# EAGLE design CAN-MPU (EAGLE 9.1.1)
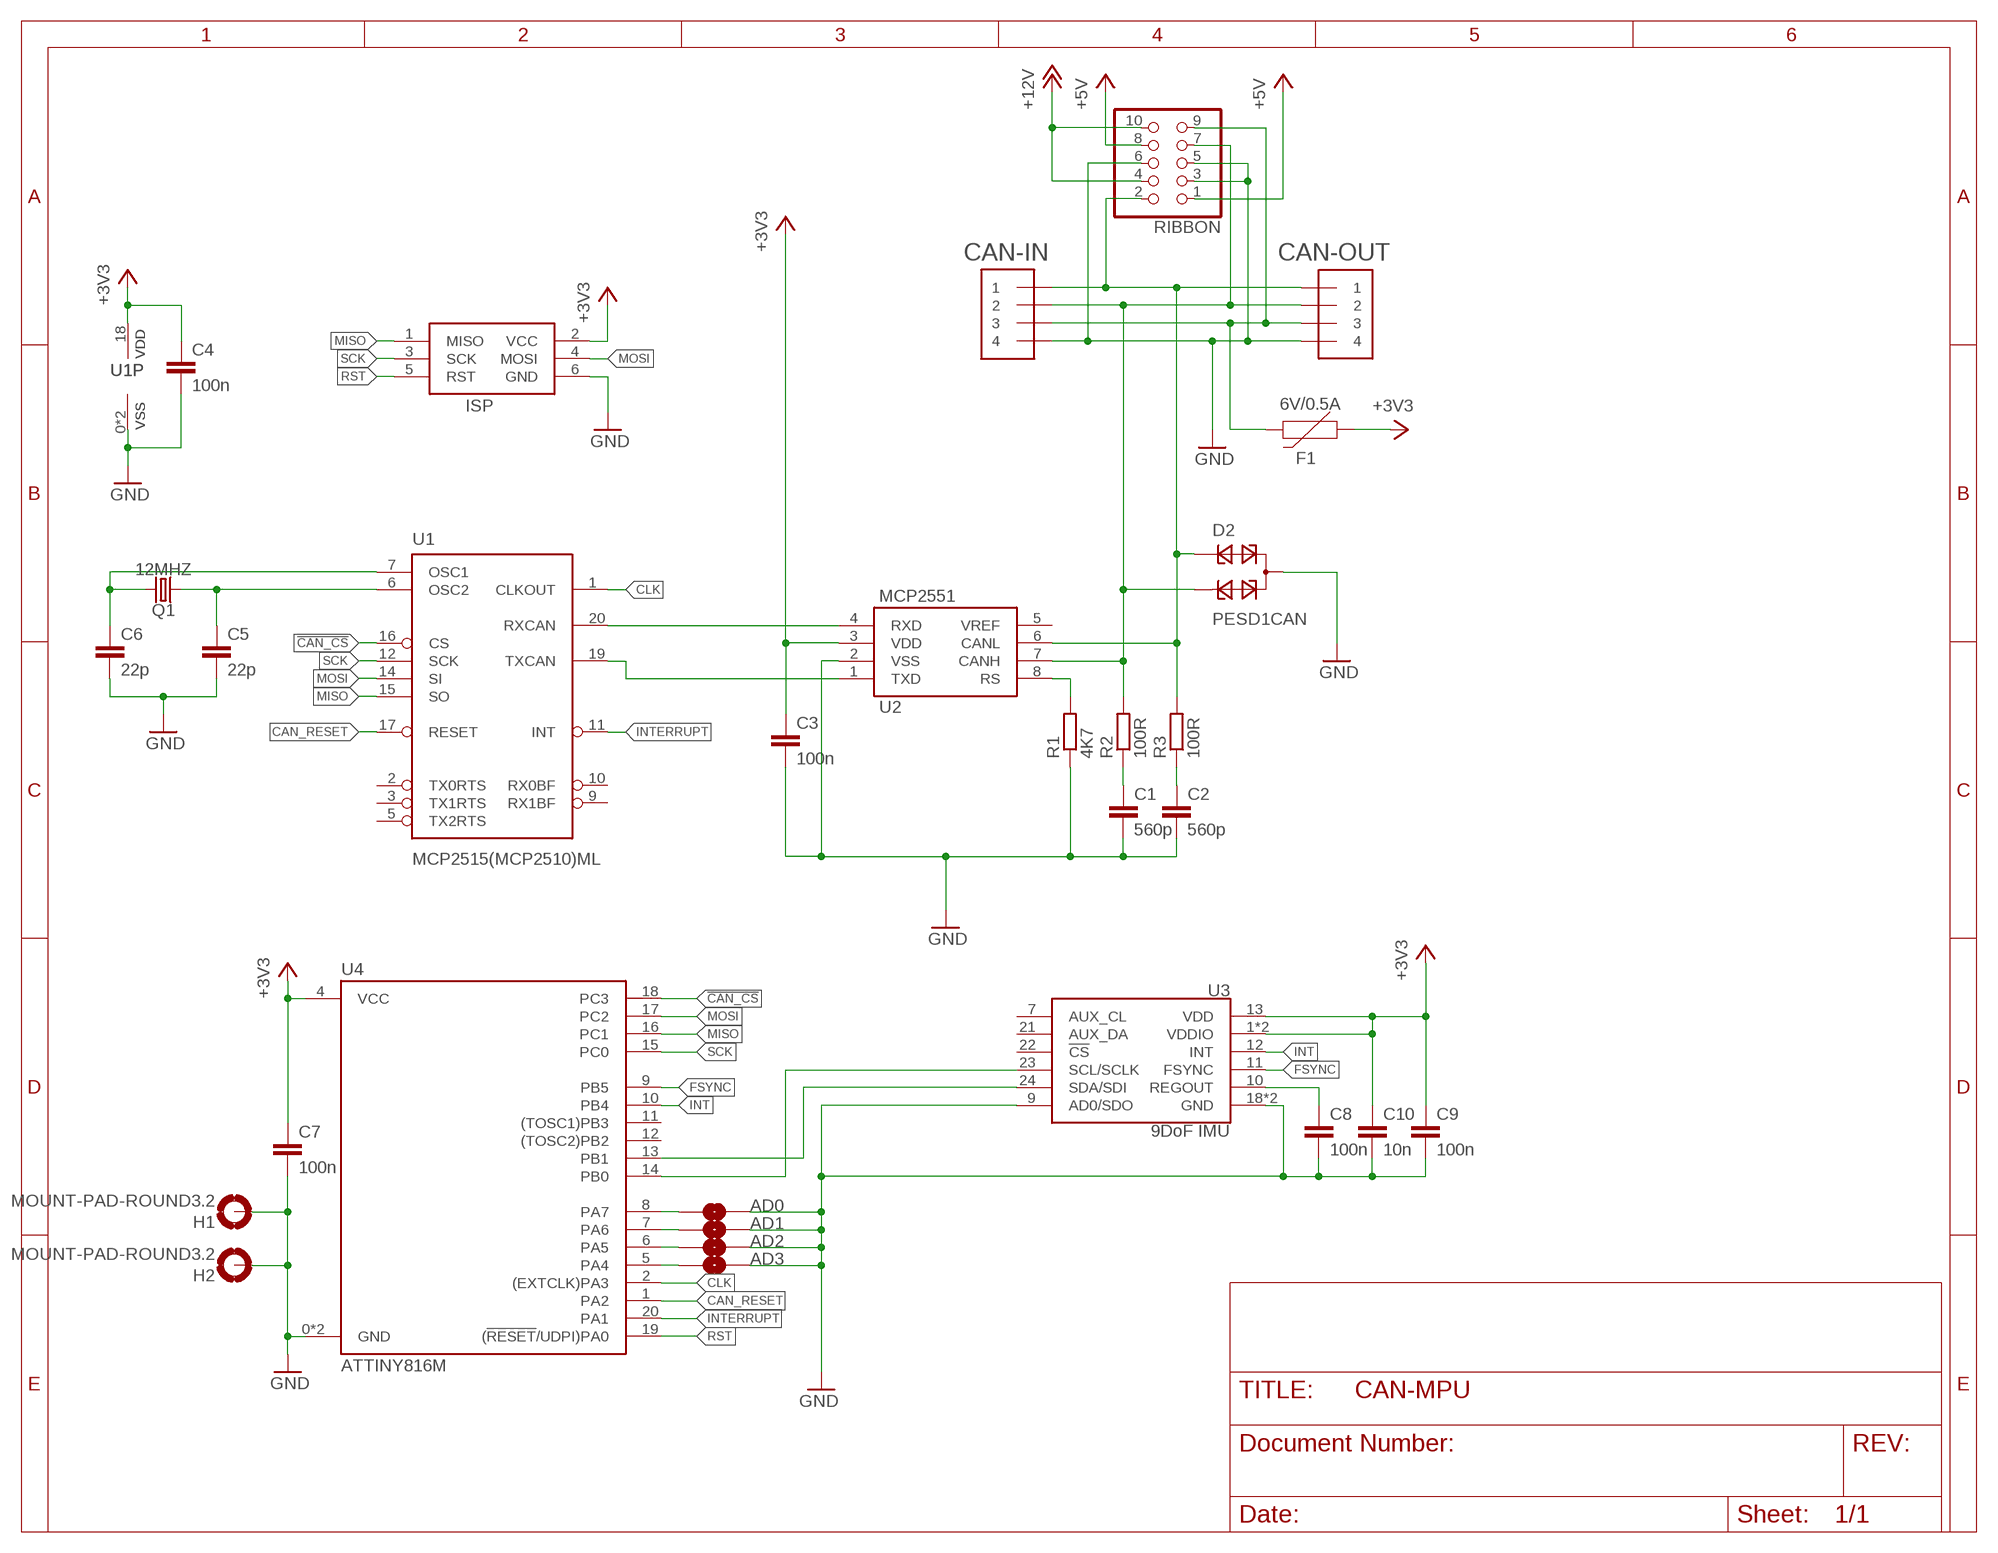
[diagram p0: schematic, sheet 1]

## Parts
AD0  JUMPER-SMT_2_NO_SILK  [SMT-JUMPER_2_NO_SILK]
AD1  JUMPER-SMT_2_NO_SILK  [SMT-JUMPER_2_NO_SILK]
AD2  JUMPER-SMT_2_NO_SILK  [SMT-JUMPER_2_NO_SILK]
AD3  JUMPER-SMT_2_NO_SILK  [SMT-JUMPER_2_NO_SILK]
C1  560p  C-EUC0603  [C0603]
C2  560p  C-EUC0603  [C0603]
C3  100n  C-EUC0603  [C0603]
C4  100n  C-EUC0603  [C0603]
C5  22p  C-EUC0603  [C0603]
C6  22p  C-EUC0603  [C0603]
C7  100n  C-EUC0603  [C0603]
C8  100n  C-EUC0603  [C0603]
C9  100n  C-EUC0603  [C0603]
C10  10n  C-EUC0603  [C0603]
CAN-IN  STRAWSON_EAGLE_LIB_JST_SH_4  [STRAWSON_EAGLE_LIB_JST_SH_4_SMD]
CAN-OUT  STRAWSON_EAGLE_LIB_JST_SH_4  [STRAWSON_EAGLE_LIB_JST_SH_4_SMD]
D2  PESD1CAN  [SOT23]
F1  6V/0.5A  PPTC_HALF-AMP  [1206]
H1  MOUNT-PAD-ROUND3.2  [3,2-PAD]
H2  MOUNT-PAD-ROUND3.2  [3,2-PAD]
ISP  AVRISP-6  [AVRISP]
Q1  12MHZ  CRYSTALSMD-3.2X1.5  [CRYSTAL-SMD-3.2X1.5MM]
R1  4K7  R-EU_R0603  [R0603]
R2  100R  R-EU_R0603  [R0603]
R3  100R  R-EU_R0603  [R0603]
RIBBON  PINHD-2X5_2.54-SMD  [2X05SMD]
U1  MCP2515(MCP2510)ML  [QFN20]
U2  MCP2551  [SO08]
U3  9DoF IMU  MPU-9250  [QFN24-3X3]
U4  ATTINY816M  [QFN20]

## Nets
!CAN_CS!: U1.16(CS) U4.18(PC3)
+3V3: C3.1 C4.1 C7.1 C9.1 C10.1 F1.1 ISP.2(VCC) U1.18(VDD) U2.3(VDD) U3.1(VDDIO) U3.8(VDDIO) U3.13(VDD) U4.4(VCC)
+5V: RIBBON.1 RIBBON.8
+12V: RIBBON.4 RIBBON.10
CAN_RESET: U1.17(RESET) U4.1(PA2)
CLK: U1.1(CLKOUT) U4.2((EXTCLK)PA3)
FSYNC: U3.11(FSYNC) U4.9(PB5)
GND: AD0.2 AD1.2 AD2.2 AD3.2 C1.2 C2.2 C3.2 C4.2 C5.2 C6.2 C7.2 C8.2 C9.2 C10.2 CAN-IN.4 CAN-OUT.4 D2.3 H1.B3,2(MOUNT) H2.B3,2(MOUNT) ISP.6(GND) R1.1 RIBBON.3 RIBBON.5 RIBBON.6 U1.0(VSS) U1.8(VSS) U2.2(VSS) U3.9(AD0/SDO) U3.18(GND) U3.20(GND) U4.0(GND) U4.3(GND)
INT: U3.12(INT) U4.10(PB4)
INTERRUPT: U1.11(INT) U4.20(PA1)
MISO: ISP.1(MISO) U1.15(SO) U4.16(PC1)
MOSI: ISP.4(MOSI) U1.14(SI) U4.17(PC2)
N$1: U1.20(RXCAN) U2.4(RXD)
N$2: U1.19(TXCAN) U2.1(TXD)
N$3: R1.2 U2.8(RS)
N$4: CAN-IN.2 CAN-OUT.2 D2.2 R2.2 RIBBON.7 U2.7(CANH)
N$5: CAN-IN.1 CAN-OUT.1 D2.1 R3.2 RIBBON.2 U2.6(CANL)
N$6: C1.1 R2.1
N$7: C2.1 R3.1
N$8: AD3.1 U4.5(PA4)
N$9: AD2.1 U4.6(PA5)
N$10: C6.1 Q1.P$2 U1.7(OSC1)
N$11: C5.1 Q1.P$1 U1.6(OSC2)
N$12: AD1.1 U4.7(PA6)
N$13: CAN-IN.3 CAN-OUT.3 F1.2 RIBBON.9
N$14: AD0.1 U4.8(PA7)
N$15: U3.24(SDA/SDI) U4.13(PB1)
N$16: U3.23(SCL/SCLK) U4.14(PB0)
N$17: C8.1 U3.10(REGOUT)
RST: ISP.5(RST) U4.19((!RESET!/UDPI)PA0)
SCK: ISP.3(SCK) U1.12(SCK) U4.15(PC0)
Unconnected: U1.2(TX0RTS) U1.3(TX1RTS) U1.5(TX2RTS) U1.9(RX1BF) U1.10(RX0BF) U2.5(VREF) U3.7(AUX_CL) U3.21(AUX_DA) U3.22(!CS) U4.11((TOSC1)PB3) U4.12((TOSC2)PB2)

## Library data of the parts
AD0 AD1-AD3 = SparkFun-Jumpers:JUMPER-SMT_2_NO: Normally open jumper This jumper has two pads in close proximity to each other. Apply solder to close the connection. Round pads are easier to solder for beginners, but are a lot larger. SparkFun Product that uses the round pads: SparkFun EL Sequencer <https://www.sparkfun.com/products/12781>
C1-C10 = resistor:C-EU: CAPACITOR, European symbol
CAN-IN CAN-OUT = can-library:STRAWSON_EAGLE_LIB_JST_SH_4
D2 = diode:PESD1CAN: CAN bus ESD protection diode Source: http://www.nxp.com/documents/data_sheet/PESD1CAN.pdf
F1 = SparkFun-Fuses:PPTC: Resettable Fuse PPTC Resettable Fuse. Really a sort of resistor with a polymeric positive temperature coefficient whose resistance increases dramatically with an increase in temperature. When heated by the power passing through the resistance rises causing the current to be limited, protecting the circuit. This is achieved by the transition of the polymer from a crystalline to an amorphous state where the conductive carbon separates breaking the conductive pathways found in the cool crystalline structure. When a PPTC cools back down it resumes conducting letting the circuit turn back on. SparkFun Products: SparkFun RedBoard - Programmed with Arduino <https://www.sparkfun.com/products/12757> Pro Micro - 5V/16MHz <https://www.sparkfun.com/products/12640> Arduino Pro 328 - 5V/16MHz <https://www.sparkfun.com/products/10915> MP3 Trigger <https://www.sparkfun.com/products/13720>; PROD_ID: RES-08585
H1 H2 = holes:MOUNT-PAD-ROUND: MOUNTING PAD, round
ISP = adafruit:AVRISP: AVR ISP HEADER Standard 6 pin header for AVR programming
Q1 = SparkFun-Clocks:CRYSTAL: Crystals (Generic) These are passive quartz crystals, which can be used as a clock source for a microcontroller. Crystal's are two-terminal devices. They require external "load" capacitors to generate an oscillating signal.
R1-R3 = resistor:R-EU_: RESISTOR, European symbol
RIBBON = pinhead-1:PINHD-2X5: PIN HEADER
U1 = can-library:MCP2515(MCP2510): CAN controller with SPI interface The MCP2515 controller supercedes the MCP2510 while addressing all errata associated with it. The two devices are pin compatible, either can be used with this device. 18-pin package SOIC Simple SPI interface to any MCU. One-shot mode ensures message transmission is attempted only once Databyte filtering Start-of-Frame (SOF) output Low-power CMOS Technology Datasheet <http://www.sparkfun.com/datasheets/DevTools/Arduino/MCP2515.pdf> SparkFun Products CAN-BUS Shield <https://www.sparkfun.com/products/13262> (DEV-13262)
U2 = SparkFun-IC-Comms:MCP2551: MCP2551 High Speed CAN Transceiver High speed CAN transceiver Datasheet <http://www.sparkfun.com/datasheets/DevTools/Arduino/MCP2551.pdf> SparkFun Products CAN-BUS Shield <https://www.sparkfun.com/products/13262> (DEV-13262) SparkFun OBD-II UART <https://www.sparkfun.com/products/9555> (WIG-09555); PROD_ID: IC-09907
U3 = SparkFun-Sensors:MPU-9250: MPU-9250 9 Degree of Freedom IMU System in Package that contains MPU-6500 & AK8963 NC pin 19. 2-6 & 14-17 not internally connected. May be used for PCB trace routing. Datasheet <https://cdn.sparkfun.com/assets/learn_tutorials/5/5/0/MPU9250REV1.0.pdf> SparkFun Products: SparkFun 9DoF Razor IMU M0 <https://www.sparkfun.com/products/14001> SparkFun IMU Breakout - MPU-9250 <https://www.sparkfun.com/products/13762>; PROD_ID: IC-13192
U4 = can-library:ATTINY816

## Board
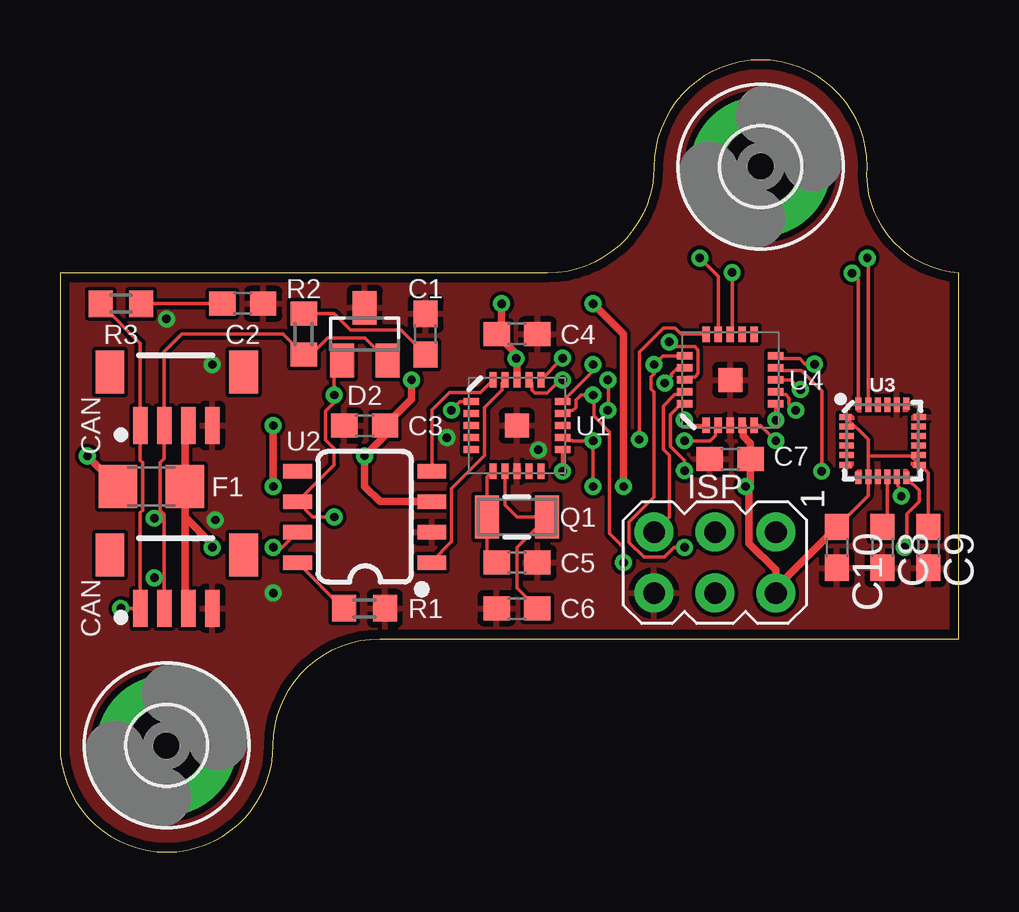
[diagram p1: board, top side]
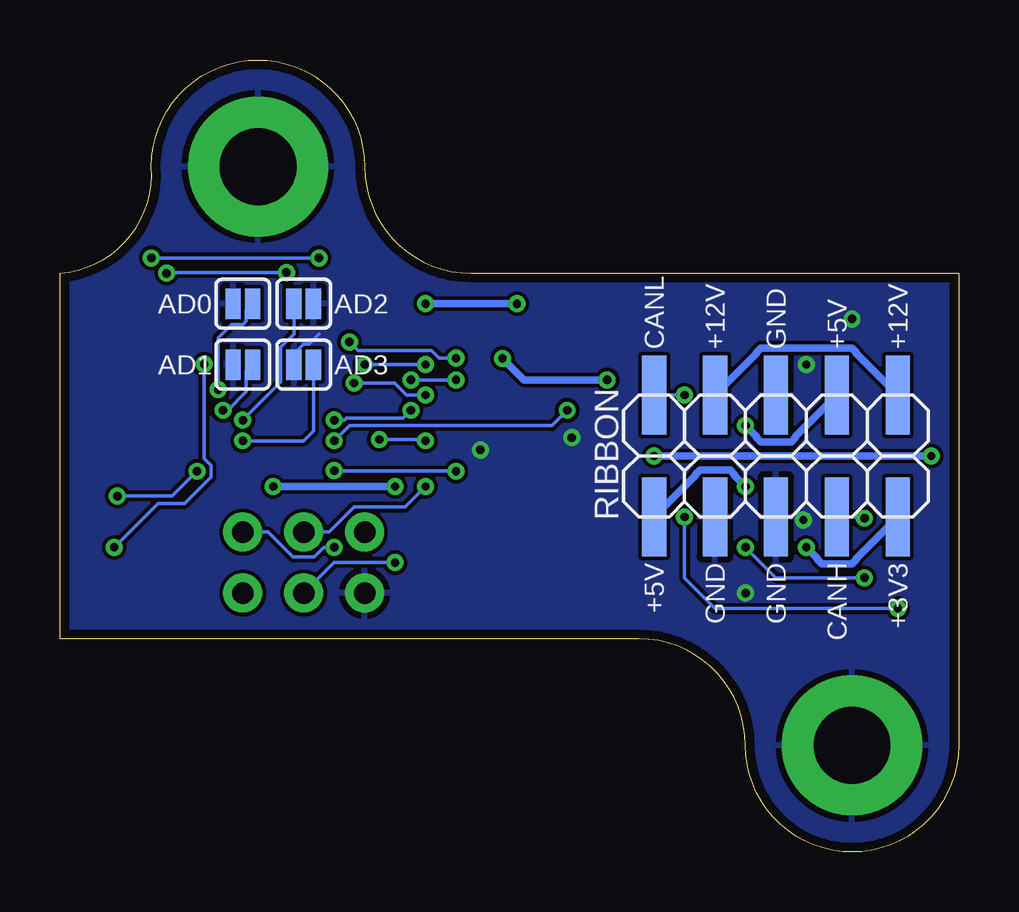
[diagram p2: board, bottom side, seen from below]

Size 37.47 x 33.02 mm. Coordinates in mm from the lower left corner, seen from the top.
Outline: 0,8.89 0,4.45 arc90 4.45,0 arc90 8.89,4.45 arc-90 13.34,8.89 37.47,8.89 37.47,24.13 arc-90 33.66,28.57 arc90 29.21,33.02 arc90 24.77,28.57 arc-90 20.32,24.13 0,24.13 0,8.89
Copper layers (1*16): Top 0.0356mm / dielectric 1.5011mm / Bottom 0.0356mm
Design rules "LaenPCBOrder *": minimum track width 6mil, minimum drill 13mil, track to track 6mil, track to pad 6mil, pad to pad 6mil, via to via 6mil, smd to smd 6mil, copper to edge 15mil, drill to drill 6mil, minimum pad ring 7mil, minimum via ring 7mil, stop-mask expansion 4mil, vias tented up to drill 15mil, thermal gap 10mil

### Footprints (pad centres in the part's own frame; a part is rotated, then mirrored left to right if it is on the bottom)
SMT-JUMPER_2_NO_SILK = smd 0.635 x 1.27: 1 -0.406,0; 2 0.406,0
C0603 = smd 1.1 x 1: 1 -0.85,0; 2 0.85,0
STRAWSON_EAGLE_LIB_JST_SH_4_SMD = smd 0.6 x 1.55: 1 0.46,1.27; 2 -0.54,1.27; 3 -1.54,1.27; 4 -2.54,1.27 | smd 1.2 x 1.8: P$1 -3.84,-0.955; P$2 1.728,-0.955
SOT23 = smd 1 x 1.4: 1 -0.95,-1.1; 2 0.95,-1.1; 3 0,1.1
1206 = smd 1.6 x 1.8: 1 -1.4,0; 2 1.4,0
3,2-PAD = drill 3.2 pad 5.842: B3,2 0,0
AVRISP = drill 0.9 pad 1.626: 1 -1.27,2.54; 2 1.27,2.54; 3 -1.27,0; 4 1.27,0; 5 -1.27,-2.54; 6 1.27,-2.54
CRYSTAL-SMD-3.2X1.5MM = smd 1 x 1.8: P$1 -1.25,0; P$2 1.25,0
R0603 = smd 1 x 1.1: 1 -0.85,0; 2 0.85,0
2X05SMD = smd 1.016 x 3.302: 1 -1.27,-3.81; 2 -1.27,1.27; 3 1.27,-3.81; 4 1.27,1.27; 5 3.81,-3.81; 6 3.81,1.27; 7 6.35,-3.81; 8 6.35,1.27; 9 8.89,-3.81; 10 8.89,1.27
QFN20 = smd 1 x 1: 0 0,0 | smd 0.65 x 0.3: 1 -1.9,1; 2 -1.9,0.5; 3 -1.9,0; 4 -1.9,-0.5; 5 -1.9,-1; 11 1.9,-1; 12 1.9,-0.5; 13 1.9,0; 14 1.9,0.5; 15 1.9,1 | smd 0.3 x 0.65: 6 -1,-1.9; 7 -0.5,-1.9; 8 0,-1.9; 9 0.5,-1.9; 10 1,-1.9; 16 1,1.9; 17 0.5,1.9; 18 0,1.9; 19 -0.5,1.9; 20 -1,1.9
SO08 = smd 0.6 x 1.2: 1 -1.905,-2.8; 2 -0.635,-2.8; 3 0.635,-2.8; 4 1.905,-2.8; 5 1.905,2.8; 6 0.635,2.8; 7 -0.635,2.8; 8 -1.905,2.8
QFN24-3X3 = smd 0.495 x 0.25: 1 -1.552,1; 6 -1.552,-1; 13 1.552,-1; 18 1.552,1 | smd 0.6 x 0.25: 2 -1.5,0.6; 3 -1.5,0.2; 4 -1.5,-0.2; 5 -1.5,-0.6; 14 1.5,-0.6; 15 1.5,-0.2; 16 1.5,0.2; 17 1.5,0.6 | smd 0.25 x 0.495: 7 -1,-1.552; 12 1,-1.552; 19 1,1.552; 24 -1,1.552 | smd 0.25 x 0.6: 8 -0.6,-1.5; 9 -0.2,-1.5; 10 0.2,-1.5; 11 0.6,-1.5; 20 0.6,1.5; 21 0.2,1.5; 22 -0.2,1.5; 23 -0.6,1.5

### Placement (x,y rotation side)
AD0  29.84,22.86 180 bottom
AD1  29.84,20.32 180 bottom
AD2  27.3,22.86 0 bottom
AD3  27.3,20.32 180 bottom
C1  15.24,21.59 90 top
C2  7.62,22.86 0 top
C3  12.7,17.78 180 top
C4  19.05,21.59 0 top
C5  19.05,12.06 0 top
C6  19.05,10.16 180 top
C7  27.94,16.38 180 top
C8  34.29,12.7 270 top
C9  36.2,12.7 270 top
C10  32.38,12.7 270 top
CAN-IN  3.81,19.05 180 top
CAN-OUT  3.81,11.43 180 top
D2  12.7,21.59 0 top
F1  3.81,15.24 0 top
H1  4.45,4.45 0 top
H2  29.21,28.57 0 top
ISP  27.3,12.06 270 top
Q1  19.05,13.97 0 top
R1  12.7,10.16 180 top
R2  10.16,21.59 270 top
R3  2.54,22.86 180 top
RIBBON  11.43,17.78 0 bottom
U1  19.05,17.78 0 top
U2  12.7,13.97 90 top
U3  34.29,17.14 0 top
U4  27.94,19.68 90 top

### Tracks (layer width: path | path; a pad name or v marks a point on that pad's centre or on a via)
!CAN_CS!  (via drill 0.35)
  Top 0.152: U1.16 v20.95,20.59 | v25.4,21.27 25.6,21.06 26.46,21.06 26.59,20.93 26.59,19.94 26.46,19.81 26.16,19.81 U4.18
  Bottom 0.152: v20.95,20.59 21.67,20.59 21.98,20.9 25.04,20.9 v25.4,21.27
+3V3  (via drill 0.35)
  Top 0.152: C9.1 36.2,15.79 U3.13 35.48,16.51 33.69,16.51 | C10.1 33.69,14.86 U3.8 33.69,16.51 | 33.69,17.19 33.69,17.14 | 33.69,17.14 33.69,16.51 | U3.1 33.69,17.19 | 33.69,17.19 33.69,17.14
  Top 0.305: F1.1 v1.14,16.51 | U2.3 13.34,14.61 12.7,15.24 v12.7,16.51 13.55,17.36 C3.1 14.65,18.88 v14.65,19.68 | 19.05,20.61 19.05,20.74 C4.1 18.41,21.8 v18.41,22.86 | v19.02,20.58 19.05,20.61 | v23.5,15.24 23.5,19.05 23.5,21.59 v22.23,22.86 | 28.79,15.88 28.79,15.46 v28.57,15.24 28.73,15.09 28.73,12.87 29.84,11.75 ISP.2 29.84,11.01 C10.1 | 28.79,15.88 C7.1 | U4.4 28.48,17.74 28.48,17.33 28.79,17.03 28.79,15.88 | U1.18 19.05,20.61
  Bottom 0.305: v1.14,16.51 v12.7,16.51 | v14.65,19.68 18.12,19.68 v19.02,20.58 | v23.5,15.24 25.4,15.24 26.04,15.24 v28.57,15.24 | v18.41,22.86 v22.23,22.86
+5V  (via drill 0.35)
  Top 0.305: v8.89,17.78 v8.89,15.24
  Bottom 0.305: v8.89,17.78 8.43,17.32 8.43,17.27 8.25,17.09 6.99,17.09 6.81,17.27 6.81,17.32 RIBBON.8 | v8.89,15.24 9.35,15.7 9.35,15.75 9.53,15.93 10.79,15.93 10.97,15.75 10.97,15.7 RIBBON.1
+12V
  Bottom 0.305: RIBBON.10 4.27,20.78 4.27,20.83 4.45,21.01 8.25,21.01 8.43,20.83 8.43,20.78 RIBBON.4
CAN_RESET  (via drill 0.35)
  Top 0.152: U1.17 19.67,19.56 19.67,19.26 19.8,19.13 20.3,19.13 20.85,19.68 v20.95,19.68 | U4.1 26.25,17.79 v26.04,18 | v22.84,18.41 22.86,18.44 22.86,19.66 v22.84,19.68
  Bottom 0.152: v22.84,19.68 v20.95,19.68 | v26.04,18 25.61,18 25.53,18.09 23.17,18.09 v22.84,18.41
CLK  (via drill 0.35)
  Top 0.152: U1.1 16.68,18.78 v16.32,18.41 | U4.2 27.32,17.66 27.32,17.36 27.1,17.14 v26.04,17.14
  Bottom 0.152: v16.32,18.41 16.95,17.78 25.4,17.78 v26.04,17.14
FSYNC  (via drill 0.35)
  Top 0.152: U4.9 29.96,20.06 30.9,20.06 31.75,19.22 v31.75,15.88 | U3.11 34.94,15.6 34.94,15.25 35.07,15.12 v35.07,14.84
  Bottom 0.152: v31.75,15.88 32.78,14.84 v35.07,14.84
GND  (via drill 0.35)
  Bottom 0.152: 26.67,21.59 27.08,21.18 27.31,21.18 27.71,20.78 AD3.2
  other vias: 6.35,20.32 19.94,16.76 8.89,10.79 6.48,13.84 4.45,22.22 16.13,17.27
  pour Top: 0,0 60.96,0 60.96,33.66 0,33.66
  pour Bottom: 0,-0.64 0,34.29 61.59,34.29 61.59,-0.64
INT  (via drill 0.35)
  Top 0.152: U3.12 35.81,15.07 35.81,14.61 35.31,14.1 35.31,12.8 v35.2,12.7 | v31.45,20.34 31.06,20.34 30.84,20.56 29.96,20.56 U4.10
  Bottom 0.152: v35.2,12.7 33.37,14.54 32.27,14.54 31.17,15.63 31.17,16.12 31.45,16.4 v31.45,20.34
INTERRUPT  (via drill 0.35)
  Top 0.152: v20.95,15.88 U1.11 | v26.04,15.9 26.04,16.32 25.45,16.9 25.45,18.24 25.79,18.58 25.94,18.58 U4.20
  Bottom 0.152: v26.04,15.9 26.01,15.88 25.4,15.88 v20.95,15.88
MISO  (via drill 0.35)
  Top 0.152: U1.15 22.23,20.05 v22.23,20.32 | U4.16 25.13,20.68 v24.77,20.32 24.77,19.93 24.63,19.79 24.63,19.31 24.77,19.17 24.77,14.81 23.72,13.77 23.72,12.9 24.33,12.29 25.2,12.29 25.6,12.7 v26.04,12.7
  Bottom 0.152: v22.23,20.32 v24.77,20.32 | v26.04,12.7 26.47,12.7 26.87,12.29 27.74,12.29 28.78,13.33 ISP.1
MOSI  (via drill 0.35)
  Top 0.152: U1.14 21.07,18.4 21.37,18.4 21.5,18.54 21.5,18.83 21.72,19.05 v22.23,19.05 22.26,19.02 22.26,18.17 22.91,17.52 22.91,13.28 23.5,12.7 v23.5,12.06 | v25.21,19.55 25.49,19.83 25.49,19.93 25.74,20.18 U4.17
  Bottom 0.152: v25.21,19.55 23.53,19.55 23.02,19.05 v22.23,19.05 | v23.5,12.06 26.04,12.06 ISP.4
N$1
  Top 0.152: U1.20 17.53,19.16 16.24,19.16 15.5,18.42 U2.4
N$2
  Top 0.152: U1.19 18.43,19.56 18.43,19.26 17.7,18.54 17.7,16.54 16.33,15.16 16.33,12.94 15.5,12.11 U2.1
N$3
  Top 0.152: U2.8 11.8,10.16 R1.2
N$4  (via drill 0.35)
  Top 0.152: 4.35,13.97 4.35,14.08 4.18,14.24 4.18,16.23 4.35,16.4 CAN-IN.2 4.35,20.86 5.08,21.59 9.31,21.59 R2.2 10.48,20.74 11.15,21.42 12.72,21.42 D2.2 | 4.35,13.97 4.35,11.43 | 4.35,11.43 CAN-OUT.2 | U2.7 9.27,12.7 v8.89,12.7 | v3.93,11.43 4.35,11.43 | v3.93,13.92 3.99,13.97 4.35,13.97
  Bottom 0.152: v3.93,11.43 7.62,11.43 v8.89,12.7 | RIBBON.7 3.99,13.97 v3.93,13.92
N$5  (via drill 0.35)
  Top 0.152: R3.2 3.35,21.2 CAN-IN.1 3.35,16.32 3.44,16.23 3.44,14.24 3.35,14.16 3.35,11.43 CAN-OUT.1 v2.54,10.16 | D2.1 11.43,20.17 v11.43,19.05 11.43,18.73 11.07,18.38 11.07,17.18 11.43,16.83 11.43,16.14 U2.6 10.54,13.97 v11.43,13.97
  Bottom 0.152: v11.43,19.05 RIBBON.2 | v11.43,13.97 11.43,11.43 10.16,10.16 v2.54,10.16
N$6
  Top 0.152: R2.1 11.43,22.44 12.11,21.76 14.22,21.76 C1.1
N$7
  Top 0.152: R3.1 C2.1
N$8  (via drill 0.35)
  Top 0.152: U4.5 29.2,17.79 v29.84,17.14
  Bottom 0.152: v29.84,17.14 27.3,17.14 26.9,17.55 AD3.1
N$9  (via drill 0.35)
  Top 0.152: U4.6 v29.84,18
  Bottom 0.152: v29.84,18 28.26,19.59 28.26,21.05 27.71,21.6 AD2.1
N$10
  Top 0.152: C6.1 19.05,11.01 19.05,12.7 20.3,13.95 Q1.P$2 19.05,13.97 18.55,14.47 U1.7
N$11
  Top 0.152: U1.6 17.8,15.63 Q1.P$1 17.8,12.46 C5.1
N$12  (via drill 0.35)
  Top 0.152: v30.67,18.41 30.61,18.41 30.39,18.63 30.39,18.93 30.26,19.06 29.96,19.06 U4.7
  Bottom 0.152: v30.67,18.41 30.48,18.41 29.7,19.19 29.7,20.05 AD1.1
N$13  (via drill 0.35)
  Top 0.305: CAN-IN.3 5.21,17.64 F1.2 5.21,13.97 | CAN-OUT.3 5.21,10.3 5.21,13.97 | v6.35,12.7 6.35,12.83 5.21,13.97
  Bottom 0.305: v6.35,12.7 5.89,12.24 5.89,12.19 5.71,12.01 4.45,12.01 4.27,12.19 4.27,12.24 RIBBON.9
N$14  (via drill 0.35)
  Top 0.152: U4.8 30.46,19.68 v30.87,19.27
  Bottom 0.152: v30.87,19.27 30.87,21.43 30.3,22 29.84,22 29.7,22.13 29.7,22.59 AD0.1
N$15  (via drill 0.35)
  Top 0.152: U4.13 28.02,21.67 v28.02,24.16 | v33.02,24.13 33.29,23.86 33.29,19.05 U3.24
  Bottom 0.152: v28.02,24.16 32.99,24.16 v33.02,24.13
N$16  (via drill 0.35)
  Top 0.152: U4.14 27.44,24 v26.67,24.77 | v33.66,24.77 33.69,24.73 U3.23
  Bottom 0.152: v26.67,24.77 v33.66,24.77
N$17
  Top 0.152: U3.10 34.49,13.75 C8.1
RST
  Top 0.152: U4.19 25.92,19.06 25.62,19.06 25.15,18.59 25.15,16.78 25.4,16.53 25.4,13.97 ISP.5
SCK  (via drill 0.35)
  Top 0.152: U4.15 25.9,21.59 25.64,21.85 25.16,21.85 24.15,20.84 v24.15,17.2 | U1.12 21.07,17.16 21.37,17.16 21.38,17.14 v22.23,17.14 v22.23,15.24
  Bottom 0.152: v24.15,17.2 22.28,17.2 v22.23,17.14 | ISP.3 26.24,13.33 25.2,14.38 23.09,14.38 v22.23,15.24

### Text on the board
tPlace: CAN | CAN
bPlace: +12V | +5V | GND | +12V | CANL | +3V3 | CANH | GND | GND | +5V